# EAGLE design FluxamasynthShield (EAGLE 6.2)
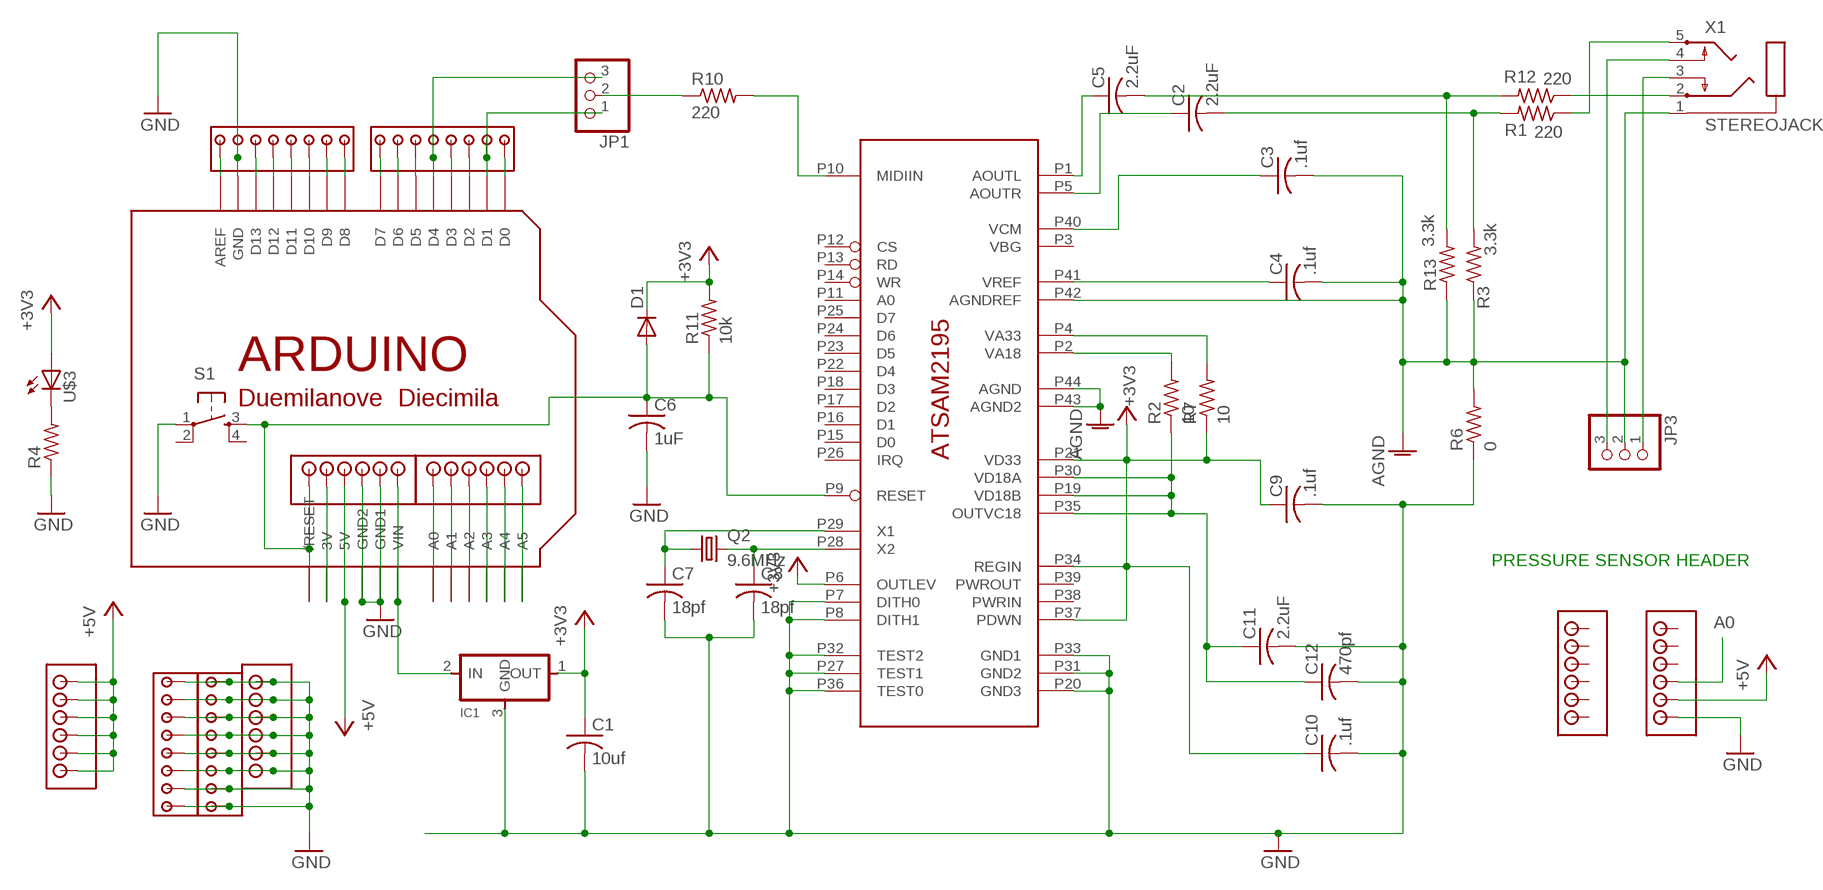
[diagram p0: schematic, sheet 1]

## Parts
C1  10uf  C-USC0805  [C0805]
C2  2.2uF  C-USC0805  [C0805]
C3  .1uf  C-USC0805  [C0805]
C4  .1uf  C-USC0805  [C0805]
C5  2.2uF  C-USC0805  [C0805]
C6  1uF  C-USC0805  [C0805]
C7  18pf  C-USC0805  [C0805]
C8  18pf  C-USC0805  [C0805]
C9  .1uf  C-USC0805  [C0805]
C10  .1uf  C-USC0805  [C0805]
C11  2.2uF  C-USC0805  [C0805]
C12  470pf  C-USC0805  [C0805]
D1  DIODESOD123  [SOD123]
IC1  REGULATORSOT23  [SOT23]
JP1  PINHD-1X3  [1X03]
JP3  PINHD-1X3  [1X03]
Q2  9.6MHz  CRYSTALTC26H  [TC26H]
R1  220  R-US_M0805  [M0805]
R2  10  R-US_M0805  [M0805]
R3  3.3k  R-US_M0805  [M0805]
R4  R-US_M0805  [M0805]
R6  0  R-US_M0805  [M0805]
R7  10  R-US_M0805  [M0805]
R10  220  R-US_M0805  [M0805]
R11  10k  R-US_M0805  [M0805]
R12  220  R-US_M0805  [M0805]
R13  3.3k  R-US_M0805  [M0805]
S1  6MM_SWITCH6MM_SWITCH  [6MM_SWITCH]
U$1  ATSAM2195  [ATSAM2195]
U$2  ARDUINODUEMILANOVE-NOHOLES  [ARDUINO-NOHOLE]
U$3  LED1206  [1206]
U$4  1X6HEADER  [1X6HEADER]
U$5  1X6HEADER  [1X6HEADER]
U$6  1X8HEADER  [1X8HEADER]
U$7  1X8HEADER  [1X8HEADER]
U$8  1X6HEADER  [1X6HEADER]
U$9  1X6HEADER  [1X6HEADER]
U$10  1X8HEADER  [1X8HEADER]
U$11  1X8HEADER  [1X8HEADER]
U$12  1X6HEADER  [1X6HEADER]
U$13  1X6HEADER  [1X6HEADER]
X1  STEREOJACK  [STX3100]

## Nets
+3V3: C1.1 C9.1 C10.1 D1.CATHODE(C) IC1.1(OUT) R7.1 R11.2 U$1.P6(OUTLEV) U$1.P21(VD33) U$1.P34(REGIN) U$1.P37(PDWN) U$3.1(A)
+5V: U$2.5V U$4.P$3 U$9.P$1 U$9.P$2 U$9.P$3 U$9.P$4 U$9.P$5 U$9.P$6 U$12.P$2
A0: U$2.A0 U$5.P$1 U$12.P$3
AGND: C3.2 C4.2 JP3.2 R3.1 R6.2 R13.1 U$1.P42(AGNDREF) U$1.P43(AGND2) U$1.P44(AGND) X1.1
CA11: C2.1 U$1.P5(AOUTR)
GND: C1.2 C6.2 C7.2 C8.2 C9.2 C10.2 C11.2 C12.2 IC1.3(GND) R4.1 R6.1 S1.1(P) U$1.P7(DITH0) U$1.P8(DITH1) U$1.P20(GND3) U$1.P27(TEST1) U$1.P31(GND2) U$1.P32(TEST2) U$1.P33(GND1) U$1.P36(TEST0) U$2.GND U$2.GND1 U$2.GND2 U$4.P$4 U$4.P$5 U$6.P$2 U$8.P$1 U$8.P$2 U$8.P$3 U$8.P$4 U$8.P$5 U$8.P$6 U$10.P$1 U$10.P$2 U$10.P$3 U$10.P$4 U$10.P$5 U$10.P$6 U$10.P$7 U$10.P$8 U$11.P$1 U$11.P$2 U$11.P$3 U$11.P$4 U$11.P$5 U$11.P$6 U$11.P$7 U$11.P$8 U$12.P$1
N$1: JP1.2 R10.1
N$2: R10.2 U$1.P10(MIDIIN)
N$3: C8.1 Q2.2 U$1.P28(X2)
N$4: IC1.2(IN) U$2.VIN U$4.P$6
N$5: C7.1 Q2.1 U$1.P29(X1)
N$6: C11.1 C12.1 R2.1 U$1.P19(VD18B) U$1.P30(VD18A) U$1.P35(OUTVC18)
N$7: R2.2 U$1.P2(VA18)
N$8: C5.1 U$1.P1(AOUTL)
N$9: R4.2 U$3.2(C)
N$10: C5.2 R12.2 R13.2
N$11: C2.2 R1.2 R3.2
N$12: C3.1 U$1.P40(VCM)
N$13: R7.2 U$1.P4(VA33)
N$14: R12.1 X1.2
N$15: U$2.D8 U$6.P$8
N$16: R1.1 X1.5
N$17: JP1.1 U$2.D1 U$7.P$7
N$18: JP1.3 U$2.D4 U$7.P$4
N$19: U$2.D9 U$6.P$7
N$20: C4.1 U$1.P41(VREF)
N$21: JP3.3 X1.4
N$22: U$2.D11 U$6.P$5
N$23: U$2.D10 U$6.P$6
N$24: JP3.1 X1.3
N$25: U$2.D12 U$6.P$4
N$26: U$2.D13 U$6.P$3
N$27: U$2.D6 U$7.P$2
N$28: U$2.AREF U$6.P$1
N$29: U$2.D5 U$7.P$3
N$30: U$2.D0 U$7.P$8
N$31: U$2.D2 U$7.P$6
N$32: U$2.D3 U$7.P$5
N$35: U$2.D7 U$7.P$1
N$36: C6.1 D1.ANODE(A) R11.1 S1.3(S) U$1.P9(RESET) U$2.RESET(/RESET) U$4.P$1
N$37: U$2.3V U$4.P$2
N$41: U$2.A1 U$5.P$2
N$42: U$2.A2 U$5.P$3
N$43: U$2.A3 U$5.P$4
N$44: U$2.A4 U$5.P$5
N$45: U$2.A5 U$5.P$6
Unconnected: S1.2(P1) S1.4(S1) U$1.P3(VBG) U$1.P11(A0) U$1.P12(CS) U$1.P13(RD) U$1.P14(WR) U$1.P15(D0) U$1.P16(D1) U$1.P17(D2) U$1.P18(D3) U$1.P22(D4) U$1.P23(D5) U$1.P24(D6) U$1.P25(D7) U$1.P26(IRQ) U$1.P38(PWRIN) U$1.P39(PWROUT) U$12.P$4 U$12.P$5 U$12.P$6 U$13.P$1 U$13.P$2 U$13.P$3 U$13.P$4 U$13.P$5 U$13.P$6

## Notes on the sheet
- PRESSURE SENSOR HEADER

## Library data of the parts
C1-C12 = rcl:C-US: CAPACITOR, American symbol
D1 = ng:DIODE: DIODE high speed (Philips)
IC1 = ng:REGULATOR
JP1 JP3 = pinhead:PINHD-1X3: PIN HEADER
Q2 = crystal:CRYSTAL: CRYSTAL
R1-R4 R6 R7 R10-R13 = rcl:R-US_: RESISTOR, American symbol
S1 = ng:6MM_SWITCH: OMRON SWITCH
U$1 = ATSAM2195:ATSAM2195
U$2 = adafruit:ARDUINO: Arduino Diecimila/Duemilanove Make a shield with ease, this package has all the named pins as well as the two mounting drill holes and an outline of the USB and DC power connector. The outline is on the DIMENSION layer, so if your board house uses it they will cut the outline to match. http://www.ladyada.net/library/pcb/eaglelibrary.html
U$3 = ng:LED
U$4 U$5 U$8 U$9 U$12 U$13 = ModernDeviceHeaders:1X6HEADER
U$6 U$7 U$10 U$11 = ModernDeviceHeaders:1X8HEADER
X1 = adafruit:STEREOJACK: MIC/HEADPHONE JACK Stereo jack with two switches. Kycon STX3100, CUI SJ1-3555NG and/or 4UCon 05544

## Board
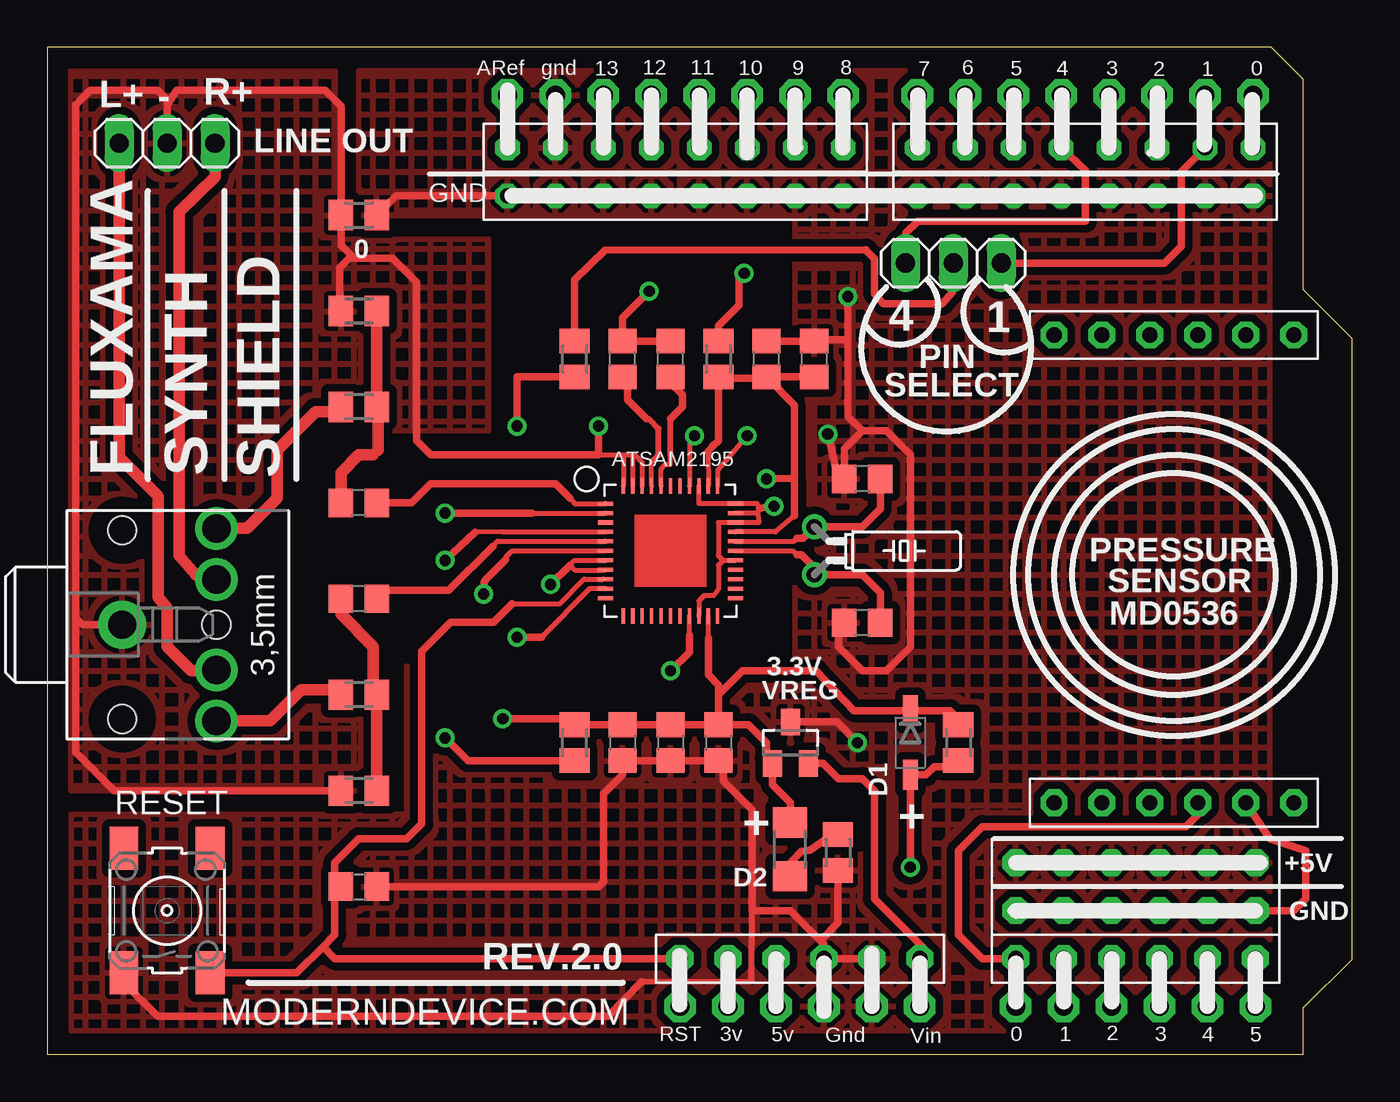
[diagram p1: board, top side]
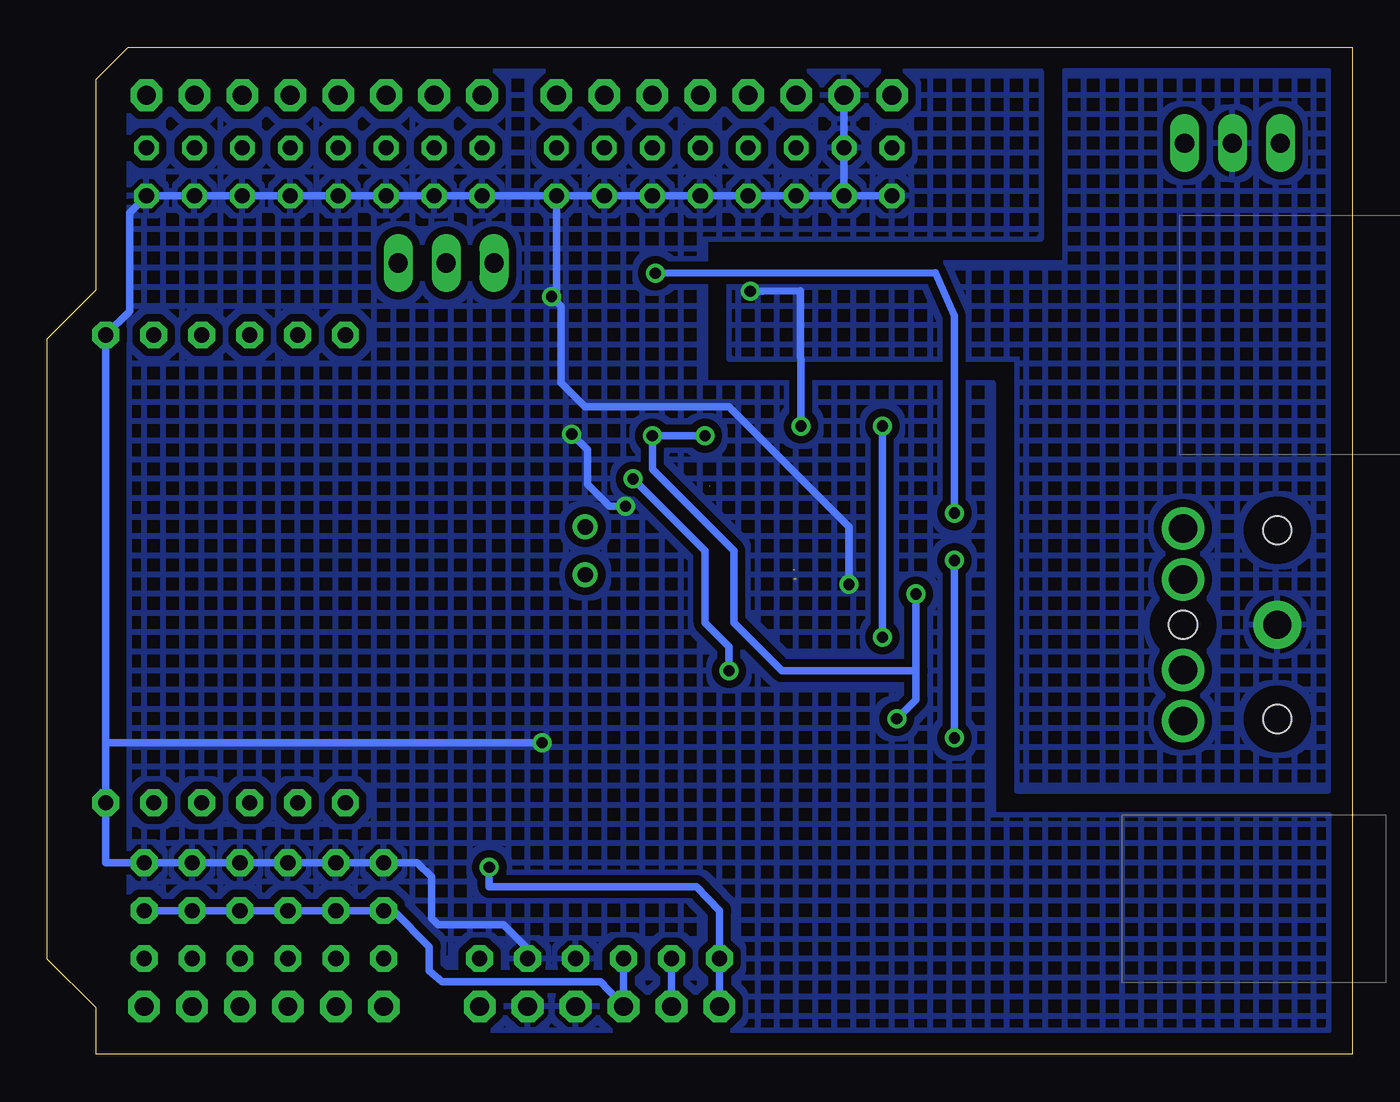
[diagram p2: board, bottom side, seen from below]

Size 69.14 x 53.34 mm. Coordinates in mm from the lower left corner, seen from the top.
Copper layers (1*16): Top 0.035mm / dielectric 1.5mm / Bottom 0.035mm
Design rules "default": minimum track width 10mil, minimum drill 24mil, track to track 8mil, track to pad 8mil, pad to pad 8mil, via to via 8mil, smd to smd 8mil, copper to edge 40mil, drill to drill 8mil, minimum pad ring 10mil, minimum via ring 8mil, stop-mask expansion 4mil, vias tented up to drill 0mil, thermal gap 10mil

### Footprints (pad centres in the part's own frame; a part is rotated, then mirrored left to right if it is on the bottom)
C0805 = smd 1.3 x 1.5: 1 -0.95,0; 2 0.95,0
SOD123 = smd 1.6 x 0.8: ANODE 1.7,0; CATHODE -1.7,0
SOT23 = smd 1 x 1.4: 1 -0.95,-1.1; 2 0.95,-1.1; 3 0,1.1
1X03 = drill 1.016 long: 1 -2.54,0; 2 0,0; 3 2.54,0
TC26H = drill 0.813 round: 1 -1.27,0; 2 1.27,0
M0805 = smd 1.3 x 1.6: 1 -0.95,0; 2 0.95,0
6MM_SWITCH = smd 2.286 x 1.524: 1 -3.302,2.286; 2 3.302,2.286; 3 -3.302,-2.286; 4 3.302,-2.286
ATSAM2195 = smd 0.813 x 0.203: P1 -3.441,2.5; P2 -3.441,2; P3 -3.441,1.5; P4 -3.441,1; P5 -3.441,0.5; P6 -3.441,0; P7 -3.441,-0.5; P8 -3.441,-1; P9 -3.441,-1.5; P10 -3.441,-2; P11 -3.441,-2.5; P23 3.441,-2.5; P24 3.441,-2; P25 3.441,-1.5; P26 3.441,-1; P27 3.441,-0.5; P28 3.441,0; P29 3.441,0.5; P30 3.441,1; P31 3.441,1.5; P32 3.441,2; P33 3.441,2.5 | smd 0.203 x 0.813: P12 -2.5,-3.441; P13 -2,-3.441; P14 -1.5,-3.441; P15 -1,-3.441; P16 -0.5,-3.441; P17 0,-3.441; P18 0.5,-3.441; P19 1,-3.441; P20 1.5,-3.441; P21 2,-3.441; P22 2.5,-3.441; P34 2.5,3.441; P35 2,3.441; P36 1.5,3.441; P37 1,3.441; P38 0.5,3.441; P39 0,3.441; P40 -0.5,3.441; P41 -1,3.441; P42 -1.5,3.441; P43 -2,3.441; P44 -2.5,3.441
ARDUINO-NOHOLE = drill 1 pad 1.676 octagon: 3V 36.068,2.54; 5V 38.608,2.54; A0 51.308,2.54; A1 53.848,2.54; A2 56.388,2.54; A3 58.928,2.54; A4 61.468,2.54; A5 64.008,2.54; AREF 24.384,50.8; D0 63.881,50.8; D1 61.341,50.8; D2 58.801,50.8; D3 56.261,50.8; D4 53.721,50.8; D5 51.181,50.8; D6 48.641,50.8; D7 46.101,50.8; D8 42.164,50.8; D9 39.624,50.8; D10 37.084,50.8; D11 34.544,50.8; D12 32.004,50.8; D13 29.464,50.8; GND 26.924,50.8; GND1 43.688,2.54; GND2 41.148,2.54; RESET 33.528,2.54; VIN 46.228,2.54
1206 = smd 1.6 x 1.803: 1 -1.422,0; 2 1.422,0
1X6HEADER = drill 0.8 pad 1.422 octagon: P$1 -6.35,0; P$2 -3.81,0; P$3 -1.27,0; P$4 1.27,0; P$5 3.81,0; P$6 6.35,0
1X8HEADER = drill 0.8 octagon: P$1 -8.89,0; P$2 -6.35,0; P$3 -3.81,0; P$4 -1.27,0; P$5 1.27,0; P$6 3.81,0; P$7 6.35,0; P$8 8.89,0
STX3100 = drill 1.5 pad 2.54 round: 1 2.7,-0.1 | drill 1.5 round: 2 7.7,5; 3 7.7,2.3; 4 7.7,-2.5; 5 7.7,-5.2 | hole 1.5: 2.7,4.9; 2.7,-5.1; 7.7,-0.1

### Placement (x,y rotation side)
C1  33.02,16.51 270 top
C2  16.51,24.13 180 top
C3  33.02,36.83 90 top
C4  30.48,36.83 90 top
C5  16.51,29.21 180 top
C6  16.51,8.89 0 top
C7  43.18,30.48 180 top
C8  43.18,22.86 180 top
C9  30.48,16.51 270 top
C10  35.56,16.51 270 top
C11  38.1,36.83 90 top
C12  40.64,36.83 90 top
D1  45.72,16.51 270 top
IC1  39.37,16.51 0 top
JP1  48.01,41.91 180 top
JP3  6.35,48.26 180 top
Q2  40.64,26.67 270 top
R1  16.51,19.05 0 top
R2  35.56,36.83 90 top
R3  16.51,13.97 0 top
R4  41.89,10.7 90 top
R6  16.51,44.45 180 top
R7  27.94,16.51 270 top
R10  27.94,36.83 270 top
R11  48.26,16.51 90 top
R12  16.51,34.29 0 top
R13  16.51,39.37 0 top
S1  6.35,7.62 90 top
U$1  33.02,26.67 0 top
U$2  0,0 0 top
U$3  39.35,10.87 270 top
U$4  39.88,5.08 0 top
U$5  57.66,5.08 0 top
U$6  33.27,48.01 0 top
U$7  54.99,48.01 0 top
U$8  57.66,10.16 0 top
U$9  57.66,7.62 0 top
U$10  33.27,45.47 0 top
U$11  54.99,45.47 0 top
U$12  59.69,13.34 180 top
U$13  59.69,38.1 0 top
X1  1.27,22.86 0 top

### Tracks (layer width: path | path; a pad name or v marks a point on that pad's centre or on a via)
+3V3  (via drill 0.6)  (1 unrouted)
  Top 0.254: U$1.P34 35.52,30.95 v37.08,32.77 | 34.02,30.09 34.02,32.51 v34.29,32.77 | 27.62,17.78 R7.1 | U$1.P6 24.64,26.67 24.29,26.32 24.27,26.2 | 35.02,22.04 35.02,22.94 U$1.P21
  Top 0.406: C10.1 C1.1 C9.1 R7.1 | C10.1 35.56,19.05 | 35.56,19.05 35.56,19.56 35.02,20.1 35.02,22.05 35.02,22.04 | v24.13,17.78 27.62,17.78 | C10.1 37.15,17.46 38.1,16.51 38.1,15.73 IC1.1 38.42,14.29 39.37,13.34 39.37,12.31 U$3.1 | 35.56,19.05 36.83,20.32 40.73,20.32 42.75,18.21 D1.CATHODE 47.83,18.21 48.26,17.78 R11.2 | v23.11,24.38 23.13,25.01 23.24,25.16 24.27,26.2
  Bottom 0.406: v34.29,32.77 v37.08,32.77 37.08,30.99 32.77,26.67 32.77,22.86 30.23,20.32 23.11,20.32 | 23.11,20.32 23.11,18.8 v24.13,17.78 | 23.11,20.32 v23.11,24.38
+5V
  Top 0.406: U$12.P$2 64.77,11.43 66.67,10.79 66.67,8.26 66.04,7.62 U$9.P$6
  Bottom 0.406: U$4.P$3 U$2.5V 39.84,3.85 48.22,3.85 48.9,4.45 48.9,5.71 50.8,7.62 U$9.P$1 U$9.P$2 U$9.P$3 U$9.P$4 U$9.P$5 U$9.P$6
A0
  Top 0.406: U$2.A0 U$5.P$1 49.53,5.08 48.26,6.35 48.26,10.79 49.53,12.06 60.33,12.06 60.96,12.7 U$12.P$3
AGND  (via drill 0.6)
  Top 0.254: U$1.P44 30.52,31.71 30.48,31.75 | 30.48,31.75 31.11,31.75 | U$1.P43 31.02,31.66 31.11,31.75 | U$1.P42 31.52,31.34 31.11,31.75 | 29.21,31.75 30.48,31.75
  Top 0.305: 30.41,37.85 C4.2
  Top 0.406: C3.2 C4.2 30.48,39.01 v31.89,40.41 | 16.26,42.16 18.29,42.16 19.56,40.89 19.56,32.51 20.32,31.75 29.21,31.75 v29.21,33.27 | 16.26,42.16 15.56,42.86 R6.2 15.56,50.23 14.73,51.05 6.86,51.05 6.35,50.29 | 16.26,42.16 16,42.16 15.49,41.66 15.49,39.44 R13.1 | R3.1 3.56,13.97 1.52,16 1.52,23.11 | 1.52,23.11 1.52,50.29 2.29,51.05 5.84,51.05 6.35,50.55 6.35,50.29 | X1.1 1.88,22.76 1.52,23.11 | 6.35,50.29 JP3.2
  Bottom 0.406: v29.21,33.27 29.24,40.45 31.24,40.41 v31.89,40.41
  pour Top (isolate 0.406, hatched): 1.27,52.07 15.24,52.07 15.24,43.18 23.37,43.18 23.37,33.02 17.78,33.02 17.78,13.97 1.27,13.97
  pour Bottom (isolate 0.406, hatched): 1.27,52.07 15.24,52.07 15.24,41.91 33.02,41.91 33.02,36.83 17.78,36.83 17.78,13.97 1.27,13.97
CA11
  Top 0.254: C2.1 17.46,24.57 | 23.62,26.92 23.87,27.18 29.56,27.18 U$1.P5
  Top 0.406: 17.46,24.57 21.27,24.57 23.62,26.92
GND  (via drill 0.6)  (1 unrouted)
  Top 0.254: 37.62,28.67 37.72,28.92 37.6,29.17 U$1.P33 34.6,29.17 34.52,29.18 34.52,29.98 U$1.P36 | 37.62,28.67 36.49,28.67 U$1.P32 | 37.62,28.67 37.7,28.19 37.68,28.17 U$1.P31 36.44,28.16 35.55,28.16 35.55,26.42 35.81,26.17 | 35.81,26.17 U$1.P27 | 35.81,26.17 35.81,26.15 35.56,25.91 35.56,24.64 35.31,24.3 34.8,24.3 34.52,24.02 34.52,23.27 U$1.P20 | U$1.P7 27.95,26.17 27.69,25.91 27.94,25.65 29.56,25.65 | C10.2 35.56,15.75 35.81,15.49
  Top 0.305: 37.33,7.62 37.32,3.87 31.5,3.85
  Top 0.406: C11.2 C12.2 40.71,37.85 42.42,37.85 | C9.2 C1.2 C10.2 | U$4.P$4 U$4.P$5 U$2.GND1 | U$4.P$4 U$2.GND2 | 43.18,33.02 42.23,32.07 C7.2 41.98,30.23 v41.35,32.86 | 43.18,33.02 44.45,33.02 45.72,31.75 45.72,21.59 44.45,20.32 43.18,20.32 41.91,21.59 41.91,22.54 C8.2 | v38.5,29.03 37.72,28.92 | 17.78,8.89 C6.2 29.21,8.89 29.46,9.14 29.46,13.81 30.48,14.82 C9.2 | U$10.P$1 18.48,45.47 R6.1 | U$11.P$2 49.28,45.47 | v26.67,24.89 27.69,25.91 | 42.42,37.85 v42.42,40.13 42.67,40.39 | 43.18,33.02 42.42,33.78 42.42,37.85 | 35.81,15.49 35.81,14.48 37.34,12.95 37.33,7.62 39.37,7.62 40.96,6.03 | C9.2 30.48,15.49 30.73,15.24 | S1.1 4.06,3.81 5.84,2.03 29.72,2.03 31.5,3.85 | IC1.3 41.83,17.61 v42.93,16.51 | U$4.P$4 41.15,5.84 40.96,6.03 | R4.1 41.89,6.96 40.96,6.03
  Bottom 0.406: U$2.GND U$6.P$2 U$10.P$2 | U$8.P$2 U$8.P$1 49.53,10.16 48.78,9.41 48.78,7.21 48.44,6.87 44.96,6.86 43.69,5.59 U$4.P$5 | U$8.P$2 U$8.P$3 U$8.P$4 U$8.P$5 U$8.P$6 66.04,10.16 U$12.P$1 66.04,16.51 | U$10.P$2 U$10.P$1 | U$10.P$2 U$10.P$3 U$10.P$4 U$10.P$5 U$10.P$6 U$10.P$7 U$10.P$8 | U$10.P$8 U$11.P$1 U$11.P$2 U$11.P$3 U$11.P$4 U$11.P$5 U$11.P$6 U$11.P$7 U$11.P$8 | U$10.P$8 42.16,40.39 v42.42,40.13 41.91,39.62 41.91,35.56 40.64,34.29 33.02,34.29 26.67,27.94 v26.67,24.89 | U$11.P$8 64.01,45.34 | U$8.P$2 53.98,10.29 | U$11.P$8 64.14,45.21 | v38.5,29.03 39.35,29.03 40.52,30.2 40.52,32.03 v41.35,32.86 | 66.04,16.51 v42.93,16.51 | 66.04,16.51 66.04,38.1 64.77,39.37 64.77,44.58 U$11.P$8
  pour Bottom (isolate 0.406, hatched): 16.51,52.07 16.51,43.18 34.29,43.18 34.29,35.56 19.05,35.56 19.05,12.7 1.27,12.7 1.27,1.27 64.77,1.27 64.77,52.07
  pour Top (isolate 0.406, hatched): 16.51,52.07 16.51,44.45 39.62,44.45 39.62,20.57 19.05,20.57 19.05,12.7 1.27,12.7 1.27,1.27 64.77,1.27 64.77,52.07
N$1
  Top 0.406: R10.1 27.94,41.03 29.54,42.58 43.38,42.61 43.38,42.59 43.83,42.14 43.83,40.3 44.31,39.75 47.41,39.75 47.96,40.36 47.96,41.86 JP1.2
N$2  (via drill 0.6)
  Top 0.254: U$1.P10 28.73,24.67 26.18,22.1
  Top 0.406: v24.89,33.27 24.89,35.88 R10.2 | 26.18,22.1 v24.89,22.1
  Bottom 0.406: v24.89,22.1 v24.89,33.27
N$3
  Top 0.254: 40.5,25.91 Q2.2 | U$1.P28 39.51,26.67 39.72,26.45
  Top 0.406: C8.1 44.13,24.45 43.18,25.4 Q2.2 | 39.72,26.45 39.95,26.45 40.5,25.91
N$4
  Top 0.406: U$2.VIN U$4.P$6 46.23,5.59 46.35,5.71 43.81,8.26 43.81,13.97 43.18,14.61 41.91,14.61 41.1,15.41 IC1.2 40.01,15.1
N$5
  Top 0.254: U$1.P29 39.55,27.17 39.72,27.34
  Top 0.406: C7.1 44.13,28.89 43.18,27.94 Q2.1 40.04,27.34 39.72,27.34
N$6  (via drill 0.6)
  Top 0.254: 35.01,31.92 U$1.P35 | U$1.P30 38.59,27.67 39.59,28.54 | 34.02,22.21 U$1.P19 | C11.1 38.03,35.81 | 35.63,35.81 R2.1
  Top 0.406: 39.59,30.52 39.59,28.54 | 39.59,30.52 39.59,34.38 C11.1 C12.1 | 38.03,35.81 35.63,35.81 | v33.02,20.32 34.02,21.29 34.02,22.21 | v38.1,30.48 39.59,30.52 | 35.01,31.92 35.22,32.17 35.56,32.51 R2.1
  Bottom 0.406: v33.02,20.32 33.02,21.59 34.29,22.86 34.29,26.67 v38.1,30.48
N$7  (via drill 0.6)
  Top 0.254: 25.69,28.67 U$1.P2
  Top 0.406: v21.08,28.67 25.69,28.67 | R2.2 35.56,38.6 36.64,39.68 36.64,41.09 v36.93,41.37
  Bottom 0.406: v21.08,28.67 21.08,39.12 22.1,41.4 v36.93,41.37
N$8
  Top 0.254: 27.69,29.46 27.94,29.17 29.54,29.17 U$1.P1
  Top 0.406: C5.1 19.3,29.21 20.32,30.23 26.92,30.23 27.69,29.46
N$9
  Top 0.406: U$3.2 39.35,10.14 39.97,10.76 40.42,10.81 41.27,11.43 41.66,11.43 R4.2
N$10
  Top 0.254: 17.53,34.22 R12.2
  Top 0.406: 17.27,31.75 17.53,32
  Top 0.61: C5.2 15.56,30.8 16.51,31.75 17.27,31.75 | 17.53,32 17.53,34.22 | R13.2 R12.2
N$11
  Top 0.254: R1.2 17.27,19.24
  Top 0.61: C2.2 15.56,23.3 17.27,21.59 17.27,19.24 | R1.2 R3.2
N$12
  Top 0.254: U$1.P40 32.52,31 32.77,31.24 33.02,31.24 33.02,31.75
  Top 0.305: 33.02,31.75 33.02,33.66
  Top 0.406: C3.1 33.02,35.56 33.66,34.92 33.66,34.29 33.02,33.66
N$13  (via drill 0.6)
  Top 0.254: U$1.P4 24.15,27.67 22.68,27.67
  Top 0.406: R7.2 22.29,15.56 v21.08,16.76 | v21.08,26.16 22.68,27.67
  Bottom 0.406: v21.08,16.76 v21.08,26.16
N$14
  Top 0.406: 15.31,34.04 R12.1
  Top 0.61: X1.2 10.59,27.86 12.19,29.46 12.19,32 14.22,34.04 15.31,34.04
N$15
  Top 0.254: U$2.D8 U$6.P$8
N$16
  Top 0.406: 15.31,19.3 R1.1
  Top 0.61: X1.5 11.82,17.66 13.46,19.3 15.31,19.3
N$17
  Top 0.406: U$2.D1 U$7.P$7 60.08,46.75 60.08,42.81 59.18,41.91 JP1.1
N$18
  Top 0.406: U$2.D4 U$7.P$4 55,46.83 55,44.13 46.12,44.13 45.5,43.51 45.5,41.94 JP1.3
N$19
  Top 0.254: U$2.D9 U$6.P$7
N$20
  Top 0.254: U$1.P41 32.02,31.39 32.38,31.75 | 30.73,35.37 C4.1
  Top 0.305: 32.38,31.75 32.38,33.15 31.88,33.66 31.75,33.66
  Top 0.406: 30.73,35.37 30.73,34.67 31.75,33.66
N$21
  Top 0.406: 8.93,20.32 X1.4
  Top 0.61: JP3.3 3.81,31.61 5.88,29.55 5.88,24.21 6.35,23.62 6.35,21.59 7.62,20.32 8.93,20.32
N$22
  Top 0.254: U$2.D11 U$6.P$5
N$23
  Top 0.254: U$2.D10 U$6.P$6
N$24
  Top 0.61: JP3.1 8.89,46.48 6.99,44.63 6.99,26.42 7.87,25.4 8.73,25.4 X1.3
N$25
  Top 0.254: U$2.D12 U$6.P$4
N$26
  Top 0.406: U$2.D13 U$6.P$3
N$27
  Top 0.406: U$7.P$2 U$2.D6
N$28
  Top 0.406: U$2.AREF U$6.P$1
N$29
  Top 0.406: U$2.D5 U$7.P$3
N$30
  Top 0.406: U$7.P$8 U$2.D0
N$31
  Top 0.406: U$7.P$6 U$2.D2
N$32
  Top 0.406: U$2.D3 U$7.P$5
N$35
  Top 0.406: U$2.D7 U$7.P$1
N$36  (via drill 0.6)  (1 unrouted)
  Top 0.254: 15.24,8.89 C6.1 15.24,9.21 | 24.64,23.88 27.18,23.88 28.45,25.18 29.46,25.18
  Top 0.406: S1.3 13.21,4.32 14.61,5.71 | 14.61,5.71 15.24,6.35 15.24,8.89 | 15.24,9.21 15.24,10.16 16.51,11.43 19.05,11.43 19.84,12.22 19.84,21.36 21.36,22.88 23.65,22.88 24.64,23.88 | U$4.P$1 15.24,5.08 14.61,5.71 | R11.1 47.94,15.24 46.99,15.24 46.56,14.81 D1.ANODE v45.72,9.91
  Bottom 0.406: U$2.RESET U$4.P$1 33.52,7.62 34.75,8.89 45.72,8.89 v45.72,9.91
N$37
  Bottom 0.406: U$4.P$2 U$2.3V
N$41
  Top 0.406: U$2.A1 U$5.P$2
N$42
  Top 0.406: U$2.A2 U$5.P$3
N$43
  Top 0.406: U$2.A3 U$5.P$4
N$44
  Top 0.406: U$2.A4 U$5.P$5
N$45
  Top 0.406: U$2.A5 U$5.P$6

### Text on the board
tPlace: L+ | - | R+ | LINE OUT | GND | 0 | 4 | 1 | PIN | SELECT | FLUXAMA | SYNTH | SHIELD | PRESSURE | SENSOR | MD0536 | 3.3V | VREG | D1 | RESET | + | + | +5V | D2 | GND | REV.2.0 | MODERNDEVICE.COM